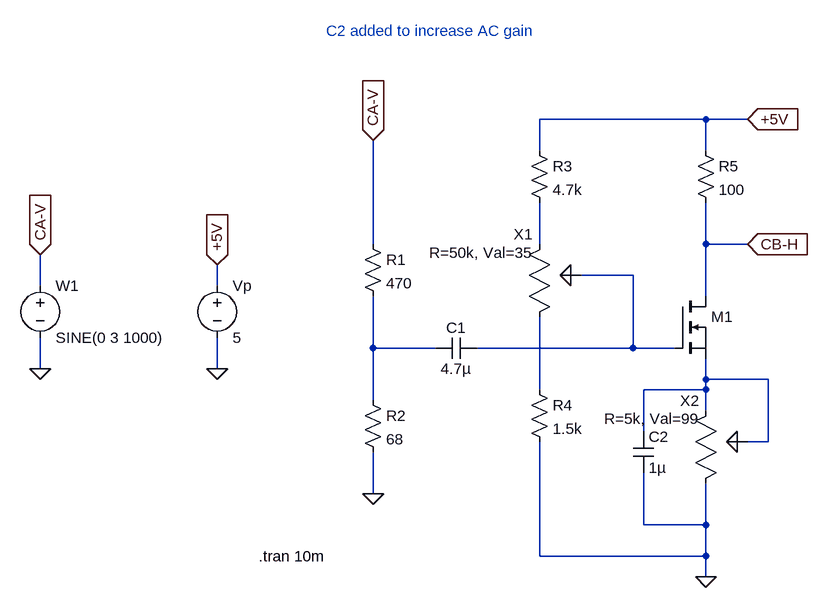
[diagram p0: schematic inc_ac_gain_ltspice.asc]
inc_ac_gain_ltspice.asc, the LTspice schematic file:
Version 4
SHEET 1 908 680
WIRE 480 -256 224 -256
WIRE 544 -256 480 -256
WIRE 224 -208 224 -256
WIRE 480 -208 480 -256
WIRE -32 -64 -32 -224
WIRE 224 -64 224 -128
WIRE 480 -64 480 -128
WIRE 544 -64 480 -64
WIRE 368 -16 288 -16
WIRE -544 0 -544 -48
WIRE -272 0 -272 -32
WIRE 480 16 480 -64
WIRE -32 96 -32 16
WIRE 64 96 -32 96
WIRE 368 96 368 -16
WIRE 368 96 128 96
WIRE 432 96 368 96
WIRE -544 128 -544 80
WIRE -272 128 -272 80
WIRE 480 144 480 112
WIRE 576 144 480 144
WIRE 224 160 224 48
WIRE 480 160 480 144
WIRE 480 160 384 160
WIRE -32 176 -32 96
WIRE 480 192 480 160
WIRE 384 224 384 160
WIRE 576 240 576 144
WIRE 576 240 544 240
WIRE -32 320 -32 256
WIRE 384 368 384 288
WIRE 480 368 480 304
WIRE 480 368 384 368
WIRE 224 416 224 240
WIRE 480 416 480 368
WIRE 480 416 224 416
WIRE 480 448 480 416
FLAG -32 320 0
FLAG -32 -224 CA-V
IOPIN -32 -224 In
FLAG 544 -256 +5V
IOPIN 544 -256 In
FLAG -544 128 0
FLAG -544 -48 CA-V
IOPIN -544 -48 In
FLAG -272 128 0
FLAG -272 -32 +5V
IOPIN -272 -32 In
FLAG 544 -64 CB-H
IOPIN 544 -64 In
FLAG 480 448 0
SYMBOL res -48 -80 R0
SYMATTR InstName R1
SYMATTR Value 470
SYMBOL res -48 160 R0
SYMATTR InstName R2
SYMATTR Value 68
SYMBOL res 208 -224 R0
SYMATTR InstName R3
SYMATTR Value 4.7k
SYMBOL res 208 144 R0
SYMATTR InstName R4
SYMATTR Value 1.5k
SYMBOL res 464 -224 R0
SYMATTR InstName R5
SYMATTR Value 100
SYMBOL cap 128 80 R90
WINDOW 0 0 32 VBottom 2
WINDOW 3 32 32 VTop 2
SYMATTR InstName C1
SYMATTR Value 4.7µ
SYMBOL nmos 432 16 R0
WINDOW 3 56 72 Invisible 2
SYMATTR Value BSP89
SYMATTR InstName M1
SYMBOL voltage -544 -16 R0
WINDOW 123 0 0 Left 0
WINDOW 39 0 0 Left 0
SYMATTR InstName W1
SYMATTR Value SINE(0 3 1000)
SYMBOL voltage -272 -16 R0
WINDOW 123 0 0 Left 0
WINDOW 39 0 0 Left 0
SYMATTR InstName Vp
SYMATTR Value 5
SYMBOL potentiometer 240 -48 M0
WINDOW 0 26 -31 Left 2
WINDOW 39 26 -3 Left 2
SYMATTR InstName X1
SYMATTR SpiceLine R=50k, Val=35
SYMBOL potentiometer 496 208 M0
WINDOW 0 26 -31 Left 2
WINDOW 39 26 -3 Left 2
SYMATTR InstName X2
SYMATTR SpiceLine R=5k, Val=99
SYMBOL cap 368 224 R0
SYMATTR InstName C2
SYMATTR Value 1µ
TEXT -208 416 Left 2 !.tran 10m
TEXT -104 -392 Left 2 ;C2 added to increase AC gain

The netlist it stands for:
* inc_ac_gain_ltspice.asc
R1 CA-V N003 470
R2 N003 0 68
R3 +5V N001 4.7k
R4 N005 0 1.5k
R5 +5V CB-H 100
C1 N002 N003 4.7µ
M1 CB-H N002 N004 N004 BSP89
V§W1 CA-V 0 SINE(0 3 1000)
Vp +5V 0 5
XX1 N001 N002 N005 potentiometer R=50k, Val=35  ; pins 1 2 3
XX2 N004 N004 0 potentiometer R=5k, Val=99  ; pins 1 2 3
C2 N004 0 1µ
.model NMOS NMOS
.model PMOS PMOS
.lib standard.mos
.tran 10m
* C2 added to increase AC gain
.backanno
.end